# Altium schematic sheet Support_NODE.SchDoc
size A
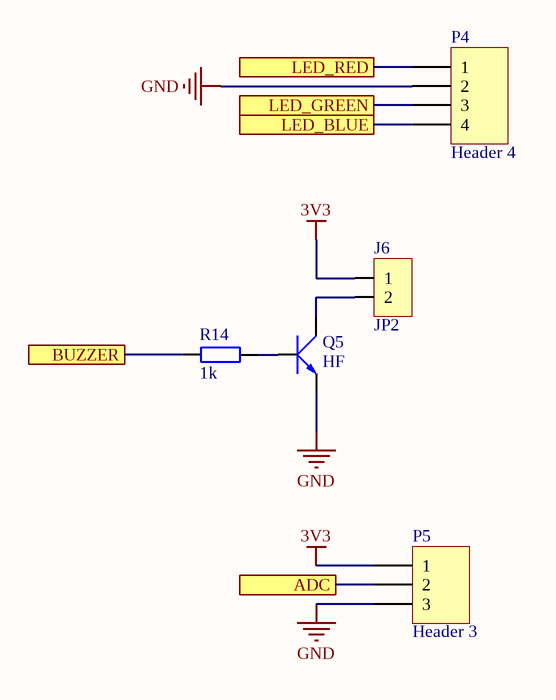
[diagram p0: Support_NODE.SchDoc]

## Parts
J6  JP2  [JP2-D1T]
P4  Header 4  [Header 4]
P5  Header 3  [Header 3]
Q5  HF  [SOT23]
R14  1k  [RES-SMD-0603]

## Ports
ADC, BUZZER, LED_BLUE, LED_GREEN, LED_RED

## Nets
3V3: J6.1 P5.1
GND: P4.2 P5.3 Q5.2(E)
ADC: P5.2 ; port ADC
BUZZER: R14.2 ; port BUZZER
LED_BLUE: P4.4 ; port LED_BLUE
LED_GREEN: P4.3 ; port LED_GREEN
LED_RED: P4.1 ; port LED_RED
NetJ6_2: J6.2 Q5.3(C)
NetQ5_1: Q5.1(B) R14.1

## Library data of the parts
J6 = JP2: WR-PHD 2.54 mm Angled Socket Header; Manufacturer: W¨¹rth Elektronik eiSos GmbH; partNo: 613002143121; ComponentLink1 Description: Manufacturer; ComponentLink2 Description: Datasheet; NoPins: 02; Created Date: 29 March 2013; ComponentLink1URL: http://www.we-online.com; ComponentLink2URL: http://katalog.we-online.de/em/datasheet/6130xx143121.pdf; Created by: Karrer Zheng
P4 = Header 4: Header, 4-Pin; LatestRevisionDate: 17-Jul-2002; LatestRevisionNote: Re-released for DXP Platform.; Publisher: Altium Limited
P5 = Header 3: Header, 3-Pin; LatestRevisionDate: 17-Jul-2002; LatestRevisionNote: Re-released for DXP Platform.; Publisher: Altium Limited
Q5 = C1815 HF SMD: NPN transistor; Value: C9014
R14 = Resistor - SMD: Resistor SMD; Manufacturer: Generic Components; Class: Passive; Published: 08/06/2000; Publisher: Altium Hobart Technology Centre